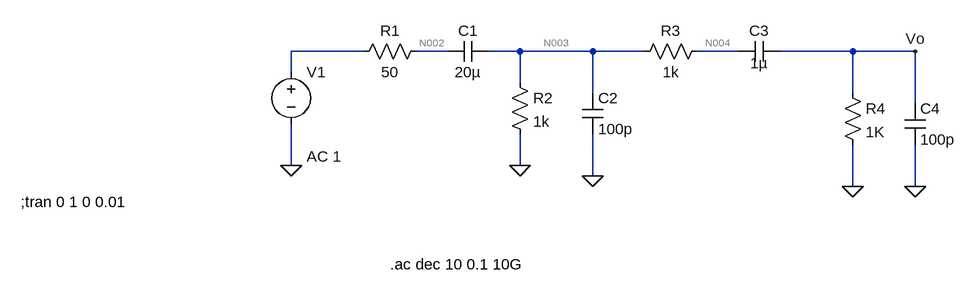
[diagram p0: schematic figure 1.2 MP1.asc]
figure 1.2 MP1.asc, the LTspice schematic file:
Version 4
SHEET 1 880 680
WIRE -112 16 -224 16
WIRE 16 16 -32 16
WIRE 128 16 80 16
WIRE 240 16 128 16
WIRE 320 16 240 16
WIRE 464 16 400 16
WIRE 640 16 528 16
WIRE 736 16 640 16
WIRE -224 48 -224 16
WIRE 128 64 128 16
WIRE 240 80 240 16
WIRE 640 80 640 16
WIRE 736 96 736 16
WIRE -224 192 -224 128
WIRE 128 192 128 144
WIRE 240 208 240 144
WIRE 640 224 640 160
WIRE 736 224 736 160
FLAG 128 192 0
FLAG 240 208 0
FLAG 640 224 0
FLAG 736 224 0
FLAG -224 192 0
FLAG 736 16 Vo
SYMBOL res -16 0 R90
WINDOW 0 0 56 VBottom 2
WINDOW 3 32 56 VTop 2
SYMATTR InstName R1
SYMATTR Value 50
SYMBOL res 112 48 R0
SYMATTR InstName R2
SYMATTR Value 1k
SYMBOL res 416 0 R90
WINDOW 0 0 56 VBottom 2
WINDOW 3 32 56 VTop 2
SYMATTR InstName R3
SYMATTR Value 1k
SYMBOL res 624 64 R0
SYMATTR InstName R4
SYMATTR Value 1K
SYMBOL cap 528 0 R90
WINDOW 0 0 32 VBottom 2
WINDOW 3 50 32 VBottom 2
SYMATTR InstName C3
SYMATTR Value 1µ
SYMBOL cap 80 0 R90
WINDOW 0 0 32 VBottom 2
WINDOW 3 32 32 VTop 2
SYMATTR InstName C1
SYMATTR Value 20µ
SYMBOL cap 224 80 R0
SYMATTR InstName C2
SYMATTR Value 100p
SYMBOL cap 720 96 R0
SYMATTR InstName C4
SYMATTR Value 100p
SYMBOL voltage -224 32 R0
WINDOW 123 24 146 Left 2
WINDOW 39 0 0 Left 0
SYMATTR Value2 AC 1
SYMATTR InstName V1
SYMATTR Value ""
TEXT -640 248 Left 2 !;tran 0 1 0 0.01
TEXT -72 344 Left 2 !.ac dec 10 0.1 10G

The netlist it stands for:
* figure 1.2 MP1.asc
R1 N002 N001 50
R2 N003 0 1k
R3 N004 N003 1k
R4 Vo 0 1K
C3 Vo N004 1µ
C1 N003 N002 20µ
C2 N003 0 100p
C4 Vo 0 100p
V1 N001 0 AC 1
;tran 0 1 0 0.01
.ac dec 10 0.1 10G
.backanno
.end

* Results of the author's LTspice run, read from the files saved beside the schematic
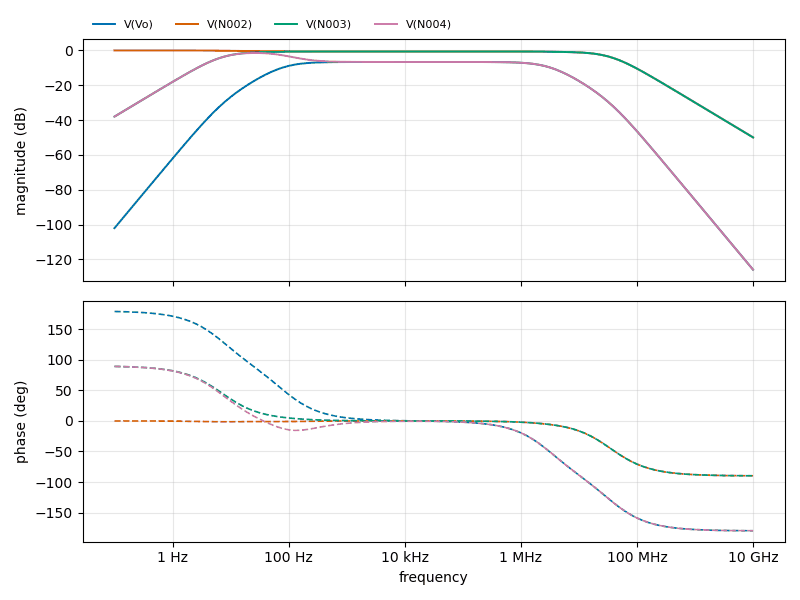
[diagram p1: AC Analysis of figure 1.2 MP1.asc, plotted from the saved traces]
* AC Analysis, 1 run:
*   V(Vo): -102.05 dB at 100 mHz, -125.91 dB at 10 GHz, peak -6.65 dB at 15.85 kHz, 3 dB below the peak at 82.55 Hz and 3.071 MHz
*   V(N002): -0.00 dB at 100 mHz, -49.94 dB at 10 GHz, peak -0.00 dB at 100 mHz, 3 dB below the peak at 27.99 MHz
*   V(N003): -38.02 dB at 100 mHz, -49.94 dB at 10 GHz, peak -0.63 dB at 15.85 kHz, 3 dB below the peak at 7.629 Hz and 33.18 MHz
*   V(N004): -38.02 dB at 100 mHz, -125.91 dB at 10 GHz, peak -1.48 dB at 25.12 Hz, 3 dB below the peak at 6.326 Hz and 149.1 Hz